# Altium project VHF_AMP.PrjPcb (part 2 of 5)

## Sheet PWR_stage.SchDoc: =MainTitle
size 420 x 297 mm; SheetNumber: 3; SheetTotal: 9; EDA_Number: ARTIQ; Projet: ARTIQ/SINARA; ModifiedBy: -; CreateDate: XX/XX/XXXX; CheckedDate: -; Title2: Power Stage; DivGrp: ISE; Designer: shanasz
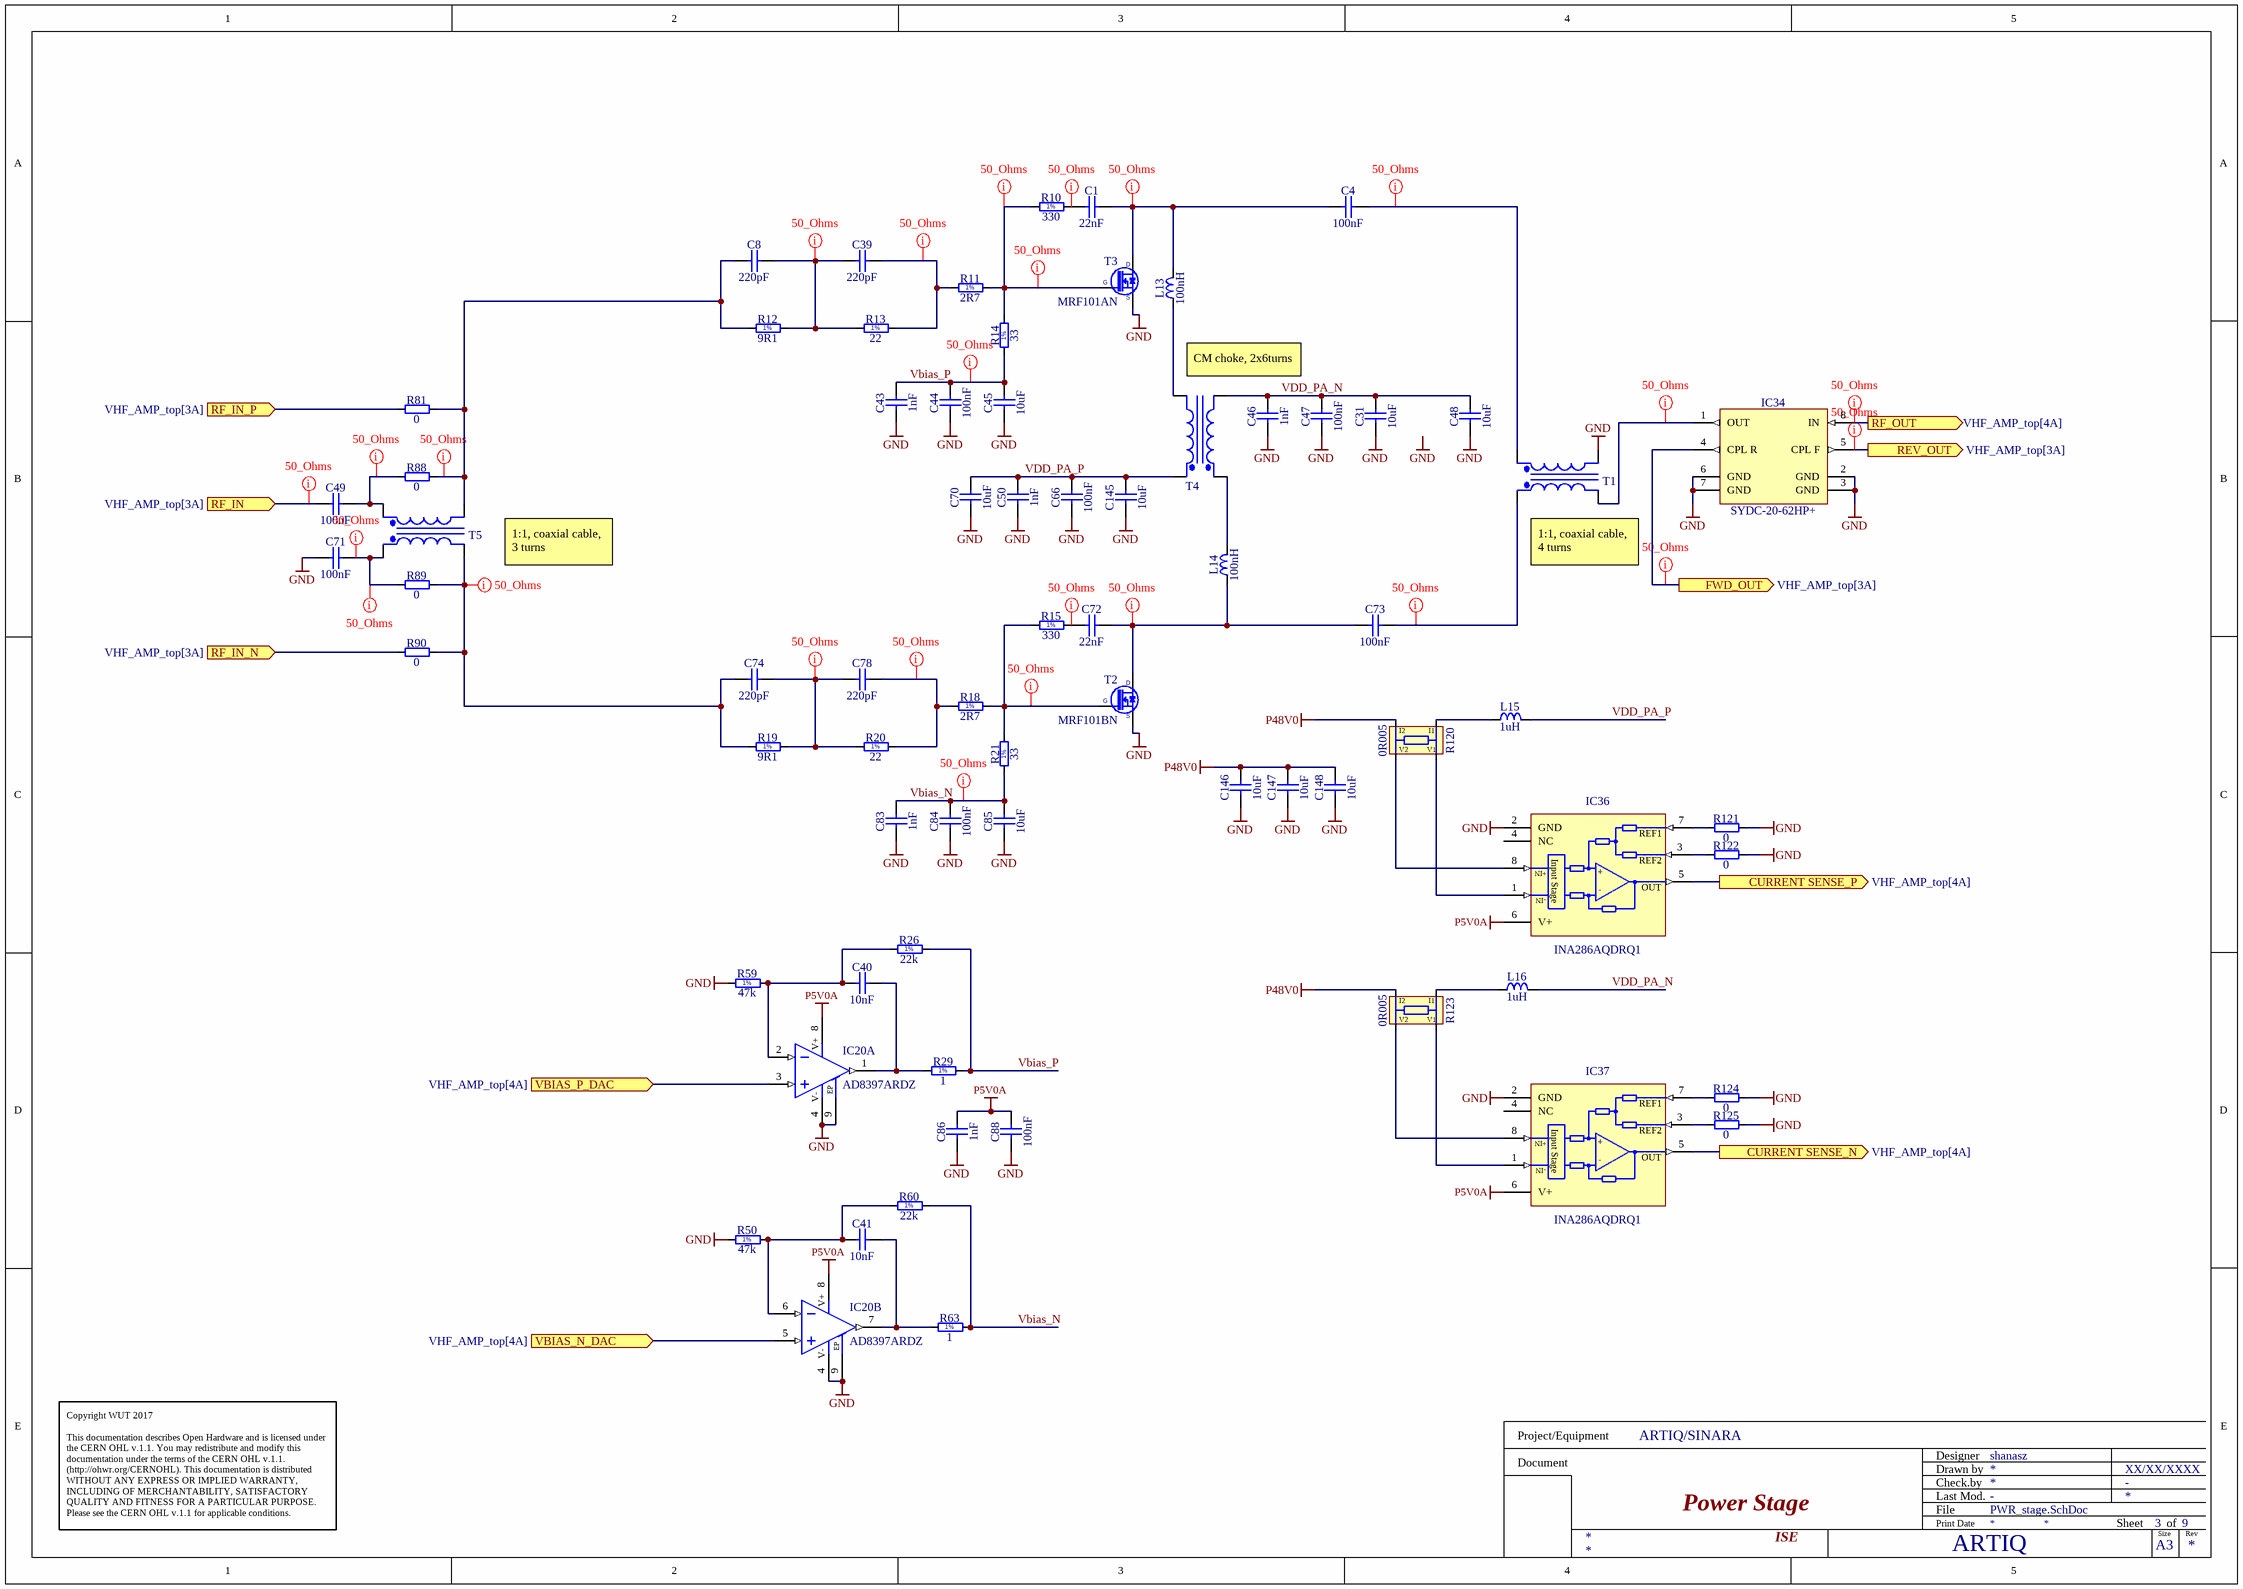
[diagram p2: PWR_stage.SchDoc]

### Parts
C1  22nF  [CAPC2012X135N]
C4  100nF  [CAPC3216X140N]
C8  220pF  [CAPC2012X135N]
C31  10uF  [CAPC_TDK_CKG45N]
C39  220pF  [CAPC2012X135N]
C40  10nF  [CAPC1005X55N]
C41  10nF  [CAPC1005X55N]
C43  1nF  [CAPC2012X135N]
C44  100nF  [CAPC3216X140N]
C45  10uF  [CAPC3225X280N]
C46  1nF  [CAPC2012X135N]
C47  100nF  [CAPC3216X140N]
C48  10uF  [CAPC_TDK_CKG45N]
C49  100nF  [CAPC2012X135N]
C50  1nF  [CAPC2012X135N]
C66  100nF  [CAPC3216X140N]
C70  10uF  [CAPC_TDK_CKG45N]
C71  100nF  [CAPC2012X135N]
C72  22nF  [CAPC2012X135N]
C73  100nF  [CAPC3216X140N]
C74  220pF  [CAPC2012X135N]
C78  220pF  [CAPC2012X135N]
C83  1nF  [CAPC2012X135N]
C84  100nF  [CAPC3216X140N]
C85  10uF  [CAPC3225X280N]
C86  1nF  [CAPC2012X135N]
C88  100nF  [CAPC2012X135N]
C145  10uF  [CAPC_TDK_CKG45N]
C146  10uF  [CAPC_TDK_CKG45N]
C147  10uF  [CAPC_TDK_CKG45N]
C148  10uF  [CAPC_TDK_CKG45N]
IC20  AD8397ARDZ  [SOIC127P600X175-9N-R241X309]  (parts A,B of 2)
IC34  SYDC-20-62HP+  [MINI-CIRCUITS_AH202-1]
IC36  INA286AQDRQ1  [SOIC127P600X175-8N]
IC37  INA286AQDRQ1  [SOIC127P600X175-8N]
L13  100nH  [IND_COILCRAFT_1812SMS]
L14  100nH  [IND_COILCRAFT_1812SMS]
L15  1uH  [IND_BOURNS_SRN3015]
L16  1uH  [IND_BOURNS_SRN3015]
R10  330  [RESC2012X60N]
R11  2R7  [RESC2012X60N]
R12  9R1  [RESC2012X60N]
R13  22  [RESC2012X60N]
R14  33  [RESC2012X60N]
R15  330  [RESC2012X60N]
R18  2R7  [RESC2012X60N]
R19  9R1  [RESC2012X60N]
R20  22  [RESC2012X60N]
R21  33  [RESC2012X60N]
R26  22k  [RESC1005X40N]
R29  1  [RESC1005X40N]
R50  47k  [RESC1005X40N]
R59  47k  [RESC1005X40N]
R60  22k  [RESC1005X40N]
R63  1  [RESC1005X40N]
R81  0  [RESC2012X60N]
R88  0  [RESC2012X60N]
R89  0  [RESC2012X60N]
R90  0  [RESC2012X60N]
R120  0R005  [RES_OHMITE_LVK25]
R121  0  [RESC2012X60N]
R122  0  [RESC2012X60N]
R123  0R005  [RES_OHMITE_LVK25]
R124  0  [RESC2012X60N]
R125  0  [RESC2012X60N]
T1  Trans Ideal  [Balun_5961000601]  (value not drawn)
T2  MRF101BN  [TO-220-HFLIP]
T3  MRF101AN  [TO-220-HFLIP]
T4  Trans Ideal  [Balun_5961000601_power]  (value not drawn)
T5  Trans Ideal  [Balun_5943001101]  (value not drawn)

### Ports
CURRENT SENSE_N (out, see VHF_AMP_top[4A]), CURRENT SENSE_P (out, see VHF_AMP_top[4A]), FWD_OUT (out, see VHF_AMP_top[3A]), REV_OUT (out, see VHF_AMP_top[3A]), RF_IN (in, see VHF_AMP_top[3A]), RF_IN_N (in, see VHF_AMP_top[3A]), RF_IN_P (in, see VHF_AMP_top[3A]), RF_OUT (out, see VHF_AMP_top[4A]), VBIAS_N_DAC (in, see VHF_AMP_top[4A]), VBIAS_P_DAC (in, see VHF_AMP_top[4A])

### Nets
GND: C31.1 C43.1 C44.1 C45.1 C46.1 C47.1 C48.1 C50.1 C66.1 C70.1 C71.1 C83.1 C84.1 C85.1 C86.1 C88.1 C145.1 C146.1 C147.1 C148.1 IC20.4(V-) IC20.9(Exposed_Pad) IC34.2(GND) IC34.3(GND) IC34.6(GND) IC34.7(GND) IC36.2(GND) IC37.2(GND) R50.2 R59.2 R121.2 R122.2 R124.2 R125.2 T1.2(Pri-) T2.2(S) T3.2(S)
P5V0A: C86.2 C88.2 IC20.8(V+) IC36.6(V+) IC37.6(V+)
P48V0: C146.2 C147.2 C148.2 R120.I2 R123.I2
CSN_N_ADC: IC37.5(OUT) ; port CURRENT SENSE_N
CSN_P_ADC: IC36.5(OUT) ; port CURRENT SENSE_P
DRV_out_N: R90.1 ; port RF_IN_N
DRV_out_P: R81.1 ; port RF_IN_P
Vbias_N: C83.2 C84.2 C85.2 R21.1 R60.1 R63.2
VBIAS_N_DAC: IC20.5(IN+) ; port VBIAS_N_DAC
Vbias_P: C43.2 C44.2 C45.2 R14.1 R26.1 R29.2
VBIAS_P_DAC: IC20.3(IN+) ; port VBIAS_P_DAC
VDD_PA_N: C31.2 C46.2 C47.2 C48.2 L16.2 T4.2(Pri-)
VDD_PA_P: C50.2 C66.2 C70.2 C145.2 L15.2 T4.3(Sec+)
NetC1_1: C1.1 R10.2
NetC1_2: C1.2 C4.1 L13.2 T3.3(D)
NetC4_2: C4.2 T1.1(Pri+)
NetC8_1: C8.1 R12.1 R81.2 R88.2 T5.2(Pri-)
NetC8_2: C8.2 C39.1 R12.2 R13.1
NetC39_2: C39.2 R11.1 R13.2
NetC40_1: C40.1 IC20.2(IN-) R26.2 R59.1
NetC40_2: C40.2 IC20.1(OUT) R29.1
NetC41_1: C41.1 IC20.6(IN-) R50.1 R60.2
NetC41_2: C41.2 IC20.7(OUT) R63.1
NetC49_1: C49.1 ; port RF_IN
NetC49_2: C49.2 R88.1 T5.1(Pri+)
NetC71_2: C71.2 R89.1 T5.3(Sec+)
NetC72_1: C72.1 R15.2
NetC72_2: C72.2 C73.1 L14.1 T2.1(D)
NetC73_2: C73.2 T1.3(Sec+)
NetC74_1: C74.1 R19.1 R89.2 R90.2 T5.4(Sec-)
NetC74_2: C74.2 C78.1 R19.2 R20.1
NetC78_2: C78.2 R18.1 R20.2
NetIC34_1: IC34.1(OUT) T1.4(Sec-)
NetIC34_4: IC34.4(CPL_R) ; port FWD_OUT
NetIC34_5: IC34.5(CPL_F) ; port REV_OUT
NetIC34_8: IC34.8(IN) ; port RF_OUT
NetIC36_1: IC36.1(-IN) R120.V1
NetIC36_3: IC36.3(REF2) R122.1
NetIC36_7: IC36.7(REF1) R121.1
NetIC36_8: IC36.8(+IN) R120.V2
NetIC37_1: IC37.1(-IN) R123.V1
NetIC37_3: IC37.3(REF2) R125.1
NetIC37_7: IC37.7(REF1) R124.1
NetIC37_8: IC37.8(+IN) R123.V2
NetL13_1: L13.1 T4.4(Sec-)
NetL14_2: L14.2 T4.1(Pri+)
NetL15_1: L15.1 R120.I1
NetL16_1: L16.1 R123.I1
NetR10_1: R10.1 R11.2 R14.2 T3.1(G)
NetR15_1: R15.1 R18.2 R21.2 T2.3(G)

Not connected (* = marked no-connect by the designer): IC36 4(NC); IC37 4(NC)

### Layout directives
net class 50_Ohms: NetC1_1, NetC1_2, NetC4_2, NetC8_1, NetC8_2, NetC39_2, NetC49_1, NetC49_2, NetC71_2, NetC72_1, NetC72_2, NetC73_2, NetC74_1, NetC74_2, NetC78_2, NetIC34_1, NetIC34_4, NetIC34_5, NetIC34_8, NetR10_1, NetR15_1, Vbias_N, Vbias_P

### Notes on the sheet
- CM choke, 2x6turns
- (near T5) 1:1, coaxial cable, 3 turns
- (near T1) 1:1, coaxial cable, 4 turns
- Labels drawn without touching a wire or pin: GND
- Project/Equipment
- Document
- Designer
- Drawn by
- Check.by
- Copyright WUT 2017
  This documentation describes Open Hardware and is licensed under the CERN OHL v.1.1. You may redistribute and modify this documentation under the terms of the CERN OHL v.1.1. (http://ohwr.org/CERNOHL). This documentation is distributed WITHOUT ANY EXPRESS OR IMPLIED WARRANTY, INCLUDING OF MERCHANTABILITY, SATISFACTORY QUALITY AND FITNESS FOR A PARTICULAR PURPOSE. Please see the CERN OHL v.1.1 for applicable conditions.
- File
- Last Mod.
- Print Date
- Sheet
- Size
- A3
- of
- Rev
- (in symbol AD8397ARDZ, part A) EP
- (in symbol AD8397ARDZ, part B) EP
- (in symbol INA286AQDRQ1) +; Input Stage; -
- (in symbol R0402_1R_1%_0.0625W_200PPM) 1%
- (in symbol R0402_22K_1%_0.0625W_100PPM) 1%
- (in symbol R0402_47K_1%_0.0625W_100PPM) 1%
- (in symbol R0805_2R7_1%_0.125W_200PPM) 1%
- (in symbol R0805_9R1_1%_0.125W_200PPM) 1%
- (in symbol R0805_22R_1%_0.125W_100PPM) 1%
- (in symbol R0805_33R_1%_0.125W_100PPM) 1%
- (in symbol R0805_330R_1%_0.125W_100PPM) 1%

### Library data of the parts
C1 C72 = CC0805_22NF_50V_10%_X7R: Non-polarised capacitor; Part Description: SMD Multilayer Chip Ceramic Capacitor; Manufacturer: GENERIC; Manufacturer1 Part Number: 223858615641; Voltage: 50V; TC: X7R; Tolerance: ±10%; Part Number: CC0805_22NF_50V_10%_X7R; Component Kind: Standard; Component Type: Standard; Pin Count: 2; Value: 22nF; Status: Preferred; Manufacturer Part Number: CC0805_22NF_50V_10%_X7R; Case: 0805; Mounted: Yes; Socket: No; SMD: Yes; Sense: No; Manufacturer1 Example: PHYCOMP; Manufacturer1 ComponentHeight: 1.35mm; HelpURL: \\cern.ch\dfs\Applications\Altium\Datasheets\CC0805_X7R_PHYCOMP.pdf; Author: CERN DEM JLC; CreateDate: 03.12.2007; LatestRevisionDate: 03.12.2007
C4 C44 C47 C66 C73 C84 = CC1206_100NF_100V_10%_X7R: Non-polarised capacitor; Part Description: SMD Multilayer Chip Ceramic Capacitor; Manufacturer: GENERIC; Manufacturer1 Part Number: 222260115649; Voltage: 100V; TC: X7R; Tolerance: ±10%; Part Number: CC1206_100NF_100V_10%_X7R; Component Kind: Standard; Component Type: Standard; Pin Count: 2; Value: 100nF; Status: Preferred; Manufacturer Part Number: CC1206_100NF_100V_10%_X7R; Case: 1206; Mounted: Yes; Socket: No; SMD: Yes; Sense: No; Manufacturer1 Example: PHYCOMP; Manufacturer1 ComponentHeight: 1.25mm; HelpURL: \\cern.ch\dfs\Applications\Altium\Datasheets\CC1206_X7R_PHYCOMP.pdf; Author: CERN DEM JLC; CreateDate: 24.08.2009; LatestRevisionDate: 24.08.2009
C8 C39 C74 C78 = CC0805_220PF_50V_5%_C0G: Non-polarised capacitor; Part Description: SMD Multilayer Chip Ceramic Capacitor; Manufacturer: GENERIC; Manufacturer1 Part Number: C0805C151J5GACTU; Voltage: 50V; TC: C0G/NP0; Tolerance: ±5%; Part Number: CC0805_220PF_50V_5%_C0G; Component Kind: Standard; Component Type: Standard; Pin Count: 2; Value: 220pF; Status: Preferred; Manufacturer Part Number: CC0805_220PF_50V_5%_C0G; Case: 0805; Mounted: Yes; Socket: No; SMD: Yes; Sense: No; Manufacturer1 Example: KEMET; Manufacturer1 ComponentHeight: 0.88mm; HelpURL: \\cern.ch\dfs\Applications\Altium\Datasheets\CC0805_C0G_KEMET_(Commercial Grade).pdf; Author: CERN DEM JLC; CreateDate: 03.12.2007; LatestRevisionDate: 22.04.2015
C31 C48 C70 C145-C148 = CC1812_10UF_100V_20%_X7S_TDK_CKG45N: Non-polarised capacitor; Part Description: Multilayer Ceramic Chip Capacitor - Stacked Cap, CKG45N Series; Manufacturer: TDK; Manufacturer Part Number: CKG45NX7S2A106M500JH; Voltage: 100V; TC: X7S; Tolerance: ±20%; Part Number: CC1812_10UF_100V_20%_X7S_TDK_CKG45N; Component Kind: Standard; Component Type: Standard; Pin Count: 2; Value: 10uF; Status: None; Case: 1812; Mounted: Yes; Socket: No; SMD: Yes; Sense: No; ComponentHeight: 5.5mm; HelpURL: \\cern.ch\dfs\Applications\Altium\Datasheets\CC1812_X7S_TDK_CKG.pdf; Author: CERN DEM MR; CreateDate: 14.12.2017; LatestRevisionDate: 14.12.2017
C40 C41 = CC0402_10NF_16V_10%_X7R: Non-polarised capacitor; Manufacturer: GENERIC; Manufacturer1 Part Number: 223878715636; Part Description: SMD Multilayer Chip Ceramic Capacitor; TC: X7R; Tolerance: ±10%; Voltage: 16V; Case: 0402; Manufacturer Part Number: CC0402_10NF_16V_10%_X7R; Manufacturer1 Example: PHYCOMP; Part Number: CC0402_10NF_16V_10%_X7R; Pin Count: 2; SMD: Yes; Status: Not Recommended; Value: 10nF; Component Kind: Standard; Component Type: Standard; Mounted: Yes; Socket: No; Sense: No; Manufacturer1 ComponentHeight: 0.55mm; HelpURL: \\cern.ch\dfs\Applications\Altium\Datasheets\CC0402_X7R_PHYCOMP.pdf; Author: CERN DEM JLC; CreateDate: 03.12.2007; LatestRevisionDate: 03.12.2007
C43 C46 C50 C83 C86 = CC0805_1NF_50V_5%_C0G: Non-polarised capacitor; Part Description: SMD Multilayer Chip Ceramic Capacitor; Manufacturer: GENERIC; Manufacturer1 Part Number: C0805C102J5GACTU; Voltage: 50V; TC: C0G/NP0; Tolerance: ±5%; Part Number: CC0805_1NF_50V_5%_C0G; Component Kind: Standard; Component Type: Standard; Pin Count: 2; Value: 1nF; Status: None; Manufacturer Part Number: CC0805_1NF_50V_5%_C0G; Case: 0805; Mounted: Yes; Socket: No; SMD: Yes; Sense: No; Manufacturer1 Example: KEMET; Manufacturer1 ComponentHeight: 0.88mm; HelpURL: \\cern.ch\dfs\Applications\Altium\Datasheets\CC0805_C0G_KEMET_(Commercial Grade).pdf; Author: CERN DEM JLC; CreateDate: 02.02.2011; LatestRevisionDate: 22.04.2015
C45 C85 = CC1210_10UF_50V_10%_X7R_YUDEN_UMK325AB7106KMHP: Non-polarised capacitor; Part Description: SMD Multilayer Chip Ceramic Capacitor (High Dielectric Type) for Automotive / Industrial Applications; Manufacturer: TAIYO YUDEN; Voltage: 50V; TC: X7R; Tolerance: ±10%; Part Number: CC1210_10UF_50V_10%_X7R_YUDEN_UMK325AB7106KMHP; Component Kind: Standard; Component Type: Standard; Pin Count: 2; Value: 10uF; Status: Not Recommended; Manufacturer Part Number: UMK325AB7106KMHP; Case: 1210; Mounted: Yes; Socket: No; SMD: Yes; Sense: No; ComponentHeight: 2.8mm; HelpURL: \\cern.ch\dfs\Applications\Altium\Datasheets\CC1210_TAIYO-YUDEN_UMK325AB7106KMHP.pdf; Author: CERN DEM JLC; CreateDate: 30.11.2016; LatestRevisionDate: 30.12.2015
C49 C71 C88 = CC0805_100NF_50V_10%_X7R: Non-polarised capacitor; Part Description: SMD Multilayer Chip Ceramic Capacitor; Manufacturer: GENERIC; Manufacturer1 Part Number: C2012X7R1H104K085AA; Voltage: 50V; TC: X7R; Tolerance: ±10%; Part Number: CC0805_100NF_50V_10%_X7R; Component Kind: Standard; Component Type: Standard; Pin Count: 2; Value: 100nF; Status: Preferred; Manufacturer Part Number: CC0805_100NF_50V_10%_X7R; Case: 0805; Mounted: Yes; Socket: No; SMD: Yes; Sense: No; Manufacturer1 Example: TDK; Manufacturer1 ComponentHeight: 1mm; HelpURL: \\cern.ch\dfs\Applications\Altium\Datasheets\CC0805_X7R_TDK_C.pdf; Author: CERN DEM JLC; CreateDate: 03.12.2007; LatestRevisionDate: 22.04.2015
IC20 = AD8397ARDZ: Dual Operational Amplifier With Exposed Pad; Part Description: Rail-to-Rail, High Output Current Amplifier; Manufacturer: ANALOG DEVICES; PressFit: No; Bonding: No; Part Number: AD8397ARDZ; Component Kind: Standard; Component Type: Standard; Device: AD8397ARDZ; PackageDescription: SOIC 8, Pitch 1.27mm - Body 3.9x4.9mm, (w/thermal tab 2.41mm X 3.098mm), IPC Medium Density; Manufacturer Part Number: AD8397ARDZ; Pin Count: 9; Case: SOIC8; Mounted: Yes; Socket: No; SMD: Yes; Sense: No; ComponentHeight: 1.75mm; Author: CERN DEM JLC; HelpURL: \\cern.ch\dfs\Applications\Altium\Datasheets\AD8397ARDZ.pdf; CreateDate: 31.05.2011; LatestRevisionDate: 31.05.2011
IC34 = SYDC-20-62HP+: 50Ohm, 10 to 540MHz, 25W, 20dB Bi-Directional Coupler; Manufacturer: MINI-CIRCUITS; PressFit: No; Bonding: No; Part Number: SYDC-20-62HP+; Component Kind: Standard; Component Type: Standard; Device: SYDC-20-62HP+; PackageDescription: MINI-CIRCUITS AH202-1 Case, Body 12.7mm L X 9.65mm W X 6.35mm H; Part Description: 50Ohm, 10 to 540MHz, 25W, 20dB Bi-Directional Coupler; Manufacturer Part Number: SYDC-20-62HP+; Pin Count: 8; Mounted: Yes; Socket: No; SMD: Yes; Sense: No; ComponentHeight: 6.35mm; Author: CERN DEM BC; HelpURL: \\cern.ch\dfs\Applications\Altium\Datasheets\SYDC-20-62HP+.pdf; CreateDate: 26.08.2019; LatestRevisionDate: 26.08.2019
IC36 IC37 = INA286AQDRQ1: 80V, Bi-Directional, Low-/High-Side, Voltage Output Current Sense Amplifier; Part Description: 80V, Bi-Directional, Low-/High-Side, Voltage Output Current Sense Amplifier (Automotive Grade); Manufacturer: TEXAS INSTRUMENTS; PressFit: No; Bonding: No; Part Number: INA286AQDRQ1; Component Kind: Standard; Component Type: Standard; Device: INA286AQDRQ1; PackageDescription: SOIC 8, Pitch 1.27mm, Body 4x5mm, IPC Medium Density; Manufacturer Part Number: INA286AQDRQ1; Pin Count: 8; Case: SOIC8; Mounted: Yes; Socket: No; SMD: Yes; Sense: No; ComponentHeight: 1.75mm; Author: CERN DEM JLC; HelpURL: \\cern.ch\dfs\Applications\Altium\Datasheets\INA286AQDRQ1.pdf; CreateDate: 27.09.2018; LatestRevisionDate: 27.09.2018
L13 L14 = IND_100NH_5%_COILCRAFT_1812SMS-R10JLC: Inductor; Part Description: SMD Midi Spring Air Core Inductor; Power: 1.7A; Resistance: 0.0123R; Tolerance: ±5%; Part Number: IND_100NH_5%_COILCRAFT_1812SMS-R10JLC; Component Kind: Standard; Component Type: Standard; Pin Count: 2; Value: 100nH; Status: None; Manufacturer: COILCRAFT; Manufacturer Part Number: 1812SMS-R10JLC; Mounted: Yes; Socket: No; SMD: Yes; Sense: No; ComponentHeight: 4.2mm; HelpURL: \\cern.ch\dfs\Applications\Altium\Datasheets\IND_COILCRAFT_1812SMS.pdf; Author: CERN DEM JLC; CreateDate: 12.02.2015; LatestRevisionDate: 12.02.2015
L15 L16 = IND_1UH_30%_BOURNS_SRN3015: Inductor; Part Description: Semi-Shielded SMD Power Inductor; Manufacturer: BOURNS; Manufacturer Part Number: SRN3015-1R0Y; Power: 2.35A; Resistance: 0.048R; Tolerance: ±30%; Part Number: IND_1UH_30%_BOURNS_SRN3015; Component Kind: Standard; Component Type: Standard; Pin Count: 2; Value: 1uH; Status: None; Mounted: Yes; Socket: No; SMD: Yes; Sense: No; ComponentHeight: 1.5mm; HelpURL: \\cern.ch\dfs\Applications\Altium\Datasheets\IND_BOURNS_SRN3015.pdf; Author: CERN DEM JLC; CreateDate: 03.02.2015; LatestRevisionDate: 03.02.2015
R10 R15 = R0805_330R_1%_0.125W_100PPM: Resistor - 1%; Part Description: General Purpose Thick Film Chip Resistor; Manufacturer: GENERIC; Manufacturer1 Part Number: NRC10F3300TRF; Power: 0.125W; TC: ±100ppm/°C; PressFit: No; Part Number: R0805_330R_1%_0.125W_100PPM; Component Kind: Standard; Component Type: Standard; Pin Count: 2; Value: 330; Status: Preferred; Tolerance: ±1%; Manufacturer Part Number: R0805_330R_1%_0.125W_100PPM; Case: 0805; Mounted: Yes; Sense: No; Socket: No; SMD: Yes; Manufacturer1 Example: NIC COMPONENT; Manufacturer1 ComponentHeight: 0.6mm; HelpURL: \\cern.ch\dfs\Applications\Altium\Datasheets\R0805_NIC_NRC.pdf; Author: CERN DEM JLC; CreateDate: 03.12.2007; LatestRevisionDate: 13.03.2008
R11 R18 = R0805_2R7_1%_0.125W_200PPM: Resistor - 1%; Part Description: General Purpose Thick Film Chip Resistor; Manufacturer: GENERIC; Manufacturer1 Part Number: 232273462708L or RC0805FR-072R7L; Power: 0.125W; TC: ±200ppm/°C; PressFit: No; Part Number: R0805_2R7_1%_0.125W_200PPM; Component Kind: Standard; Component Type: Standard; Pin Count: 2; Value: 2R7; Status: Preferred; Tolerance: ±1%; Manufacturer Part Number: R0805_2R7_1%_0.125W_200PPM; Case: 0805; Mounted: Yes; Sense: No; Socket: No; SMD: Yes; Manufacturer1 Example: YAGEO PHYCOMP; Manufacturer1 ComponentHeight: 0.65mm; HelpURL: \\cern.ch\dfs\Applications\Altium\Datasheets\R0805_Phycomp_RC0805.pdf; Author: CERN DEM JLC; CreateDate: 03.12.2007; LatestRevisionDate: 17.10.2012
R12 R19 = R0805_9R1_1%_0.125W_200PPM: Resistor - 1%; Part Description: General Purpose Thick Film Chip Resistor; Manufacturer: GENERIC; Manufacturer1 Part Number: 232273469108L or RC0805FR-079R1L; Power: 0.125W; TC: ±200ppm/°C; PressFit: No; Part Number: R0805_9R1_1%_0.125W_200PPM; Component Kind: Standard; Component Type: Standard; Pin Count: 2; Value: 9R1; Status: Preferred; Tolerance: ±1%; Manufacturer Part Number: R0805_9R1_1%_0.125W_200PPM; Case: 0805; Mounted: Yes; Sense: No; Socket: No; SMD: Yes; Manufacturer1 Example: YAGEO PHYCOMP; Manufacturer1 ComponentHeight: 0.65mm; HelpURL: \\cern.ch\dfs\Applications\Altium\Datasheets\R0805_Phycomp_RC0805.pdf; Author: CERN DEM JLC; CreateDate: 03.12.2007; LatestRevisionDate: 17.10.2012
R13 R20 = R0805_22R_1%_0.125W_100PPM: Resistor - 1%; Part Description: General Purpose Thick Film Chip Resistor; Manufacturer: GENERIC; Manufacturer1 Part Number: NRC10F22R0TRF; Power: 0.125W; TC: ±100ppm/°C; PressFit: No; Part Number: R0805_22R_1%_0.125W_100PPM; Component Kind: Standard; Component Type: Standard; Pin Count: 2; Value: 22; Status: Preferred; Tolerance: ±1%; Manufacturer Part Number: R0805_22R_1%_0.125W_100PPM; Case: 0805; Mounted: Yes; Sense: No; Socket: No; SMD: Yes; Manufacturer1 Example: NIC COMPONENT; Manufacturer1 ComponentHeight: 0.6mm; HelpURL: \\cern.ch\dfs\Applications\Altium\Datasheets\R0805_NIC_NRC.pdf; Author: CERN DEM JLC; CreateDate: 03.12.2007; LatestRevisionDate: 13.03.2008
R14 R21 = R0805_33R_1%_0.125W_100PPM: Resistor - 1%; Part Description: General Purpose Thick Film Chip Resistor; Manufacturer: GENERIC; Manufacturer1 Part Number: NRC10F33R0TRF; Power: 0.125W; TC: ±100ppm/°C; PressFit: No; Part Number: R0805_33R_1%_0.125W_100PPM; Component Kind: Standard; Component Type: Standard; Pin Count: 2; Value: 33; Status: Preferred; Tolerance: ±1%; Manufacturer Part Number: R0805_33R_1%_0.125W_100PPM; Case: 0805; Mounted: Yes; Sense: No; Socket: No; SMD: Yes; Manufacturer1 Example: NIC COMPONENT; Manufacturer1 ComponentHeight: 0.6mm; HelpURL: \\cern.ch\dfs\Applications\Altium\Datasheets\R0805_NIC_NRC.pdf; Author: CERN DEM JLC; CreateDate: 03.12.2007; LatestRevisionDate: 13.03.2008
R26 R60 = R0402_22K_1%_0.0625W_100PPM: Resistor - 1%; Part Description: General Purpose Thick Film Chip Resistor; Manufacturer: GENERIC; Manufacturer1 Part Number: 232270672203L; TC: ±100ppm/°C; PressFit: No; Part Number: R0402_22K_1%_0.0625W_100PPM; Component Kind: Standard; Component Type: Standard; Pin Count: 2; Value: 22k; Status: Not Recommended; Power: 0.0625W; Tolerance: ±1%; Manufacturer Part Number: R0402_22K_1%_0.0625W_100PPM; Case: 0402; Mounted: Yes; Sense: No; Socket: No; SMD: Yes; Manufacturer1 Example: YAGEO PHYCOMP; Manufacturer1 ComponentHeight: 0.4mm; HelpURL: \\cern.ch\dfs\Applications\Altium\Datasheets\R0402_Phycomp_RC0402.pdf; Author: CERN DEM JLC; CreateDate: 03.12.2007; LatestRevisionDate: 17.10.2012
R29 R63 = R0402_1R_1%_0.0625W_200PPM: Resistor - 1%; Part Description: General Purpose Thick Film Chip Resistor; Manufacturer: GENERIC; Manufacturer1 Part Number: 232270671008L; TC: ±200ppm/°C; PressFit: No; Part Number: R0402_1R_1%_0.0625W_200PPM; Component Kind: Standard; Component Type: Standard; Pin Count: 2; Value: 1; Status: Not Recommended; Power: 0.0625W; Tolerance: ±1%; Manufacturer Part Number: R0402_1R_1%_0.0625W_200PPM; Case: 0402; Mounted: Yes; Sense: No; Socket: No; SMD: Yes; Manufacturer1 Example: YAGEO PHYCOMP; Manufacturer1 ComponentHeight: 0.4mm; HelpURL: \\cern.ch\dfs\Applications\Altium\Datasheets\R0402_Phycomp_RC0402.pdf; Author: CERN DEM JLC; CreateDate: 03.12.2007; LatestRevisionDate: 17.10.2012
R50 R59 = R0402_47K_1%_0.0625W_100PPM: Resistor - 1%; Part Description: General Purpose Thick Film Chip Resistor; Manufacturer: GENERIC; Manufacturer1 Part Number: 232270675103L; TC: ±100ppm/°C; PressFit: No; Part Number: R0402_47K_1%_0.0625W_100PPM; Component Kind: Standard; Component Type: Standard; Pin Count: 2; Value: 47k; Status: Not Recommended; Power: 0.0625W; Tolerance: ±1%; Manufacturer Part Number: R0402_47K_1%_0.0625W_100PPM; Case: 0402; Mounted: Yes; Sense: No; Socket: No; SMD: Yes; Manufacturer1 Example: YAGEO PHYCOMP; Manufacturer1 ComponentHeight: 0.4mm; HelpURL: \\cern.ch\dfs\Applications\Altium\Datasheets\R0402_Phycomp_RC0402.pdf; Author: CERN DEM JLC; CreateDate: 03.12.2007; LatestRevisionDate: 17.10.2012
R81 R88-R90 R121 R122 R124 R125 = R0805_0R_JUMPER: Resistor; Part Description: 2A (0.05R Max DC Resistance) Zero Ohm Jumper; Manufacturer: GENERIC; Manufacturer1 Part Number: NRC10Z0; PressFit: No; Part Number: R0805_0R_JUMPER; Component Kind: Standard; Component Type: Standard; Pin Count: 2; Value: 0; Status: Preferred; Manufacturer Part Number: R0805_0R_JUMPER; Case: 0805; Mounted: Yes; Sense: No; Socket: No; SMD: Yes; Manufacturer1 Example: NIC COMPONENT; Manufacturer1 ComponentHeight: 0.6mm; HelpURL: \\cern.ch\dfs\Applications\Altium\Datasheets\R0805_NIC_NRC.pdf; Author: CERN DEM JLC; CreateDate: 03.12.2007; LatestRevisionDate: 13.03.2008
R120 R123 = R_0R005_0.5%_2W_100PPM_OHMITE_LVK25: Power and Current Sensing Resistor; Part Description: Four Terminal High Precision Current Sense; Manufacturer: OHMITE; Manufacturer Part Number: LVK25R005DER; Power: 2W; TC: ±100ppm/°C; Tolerance: ±0.5%; PressFit: No; Part Number: R_0R005_0.5%_2W_100PPM_OHMITE_LVK25; Component Kind: Standard; Component Type: Standard; Pin Count: 4; Value: 0R005; Status: None; Mounted: Yes; Sense: No; Socket: No; SMD: Yes; ComponentHeight: 0.7mm; HelpURL: \\cern.ch\dfs\Applications\Altium\Datasheets\R_OHMITE_LVK25.pdf; Author: CERN DEM JLC; CreateDate: 21.02.2018; LatestRevisionDate: 21.02.2018
T1 T4 T5 = Balun_coaxialcable: Transformer (Ideal); Published: 8-Jun-2000; LatestRevisionDate: 17-Jul-2002; LatestRevisionNote: Re-released for DXP Platform.; PackageReference: TRF_4; Publisher: Altium Limited; PackageDescription: Transformer; 4 Leads
T2 = MRF101BN_hflip: N-CHANNEL MOSFET WITH DIODE; Part Description: 133V 115W NPN Silicon Plastic Power Transistor; Manufacturer: NXP SEMICONDUCTORS; PressFit: No; Bonding: No; Part Number: MRF101BN_hflip; Component Kind: Standard; Component Type: Standard; Device: MRF101BN; PackageDescription: TO-220 3-Terminal + Tab - Flipped Horizontal Mount; Manufacturer Part Number: MRF101BN; Pin Count: 3; Case: TO-220; Mounted: Yes; Socket: No; SMD: No; Sense: No; ComponentHeight: 4.83mm; HelpURL: \\cern.ch\dfs\Applications\Altium\Datasheets\MRF101BN.pdf; Author: CERN DEM HF; CreateDate: 13.04.2023; LatestRevisionDate: 13.04.2023
T3 = MRF101AN_hflip: N-CHANNEL MOSFET WITH DIODE; Part Description: 133V 115W NPN Silicon Plastic Power Transistor; Manufacturer: NXP SEMICONDUCTORS; PressFit: No; Bonding: No; Part Number: MRF101AN_hflip; Component Kind: Standard; Component Type: Standard; Device: MRF101AN; PackageDescription: TO-220 3-Terminal + Tab - Flipped Horizontal Mount; Manufacturer Part Number: MRF101AN; Pin Count: 3; Case: TO-220; Mounted: Yes; Socket: No; SMD: No; Sense: No; ComponentHeight: 4.83mm; HelpURL: \\cern.ch\dfs\Applications\Altium\Datasheets\MRF101AN.pdf; Author: CERN DEM HF; CreateDate: 06.04.2023; LatestRevisionDate: 06.04.2023

## Sheet RF_Driver.SchDoc: =MainTitle
size 420 x 297 mm; SheetNumber: 4; SheetTotal: 9; EDA_Number: ARTIQ; Projet: ARTIQ/SINARA; ModifiedBy: -; CreateDate: XX/XX/XXXX; CheckedDate: -; Title2: Driver Amplifier; DivGrp: ISE; Designer: shanasz
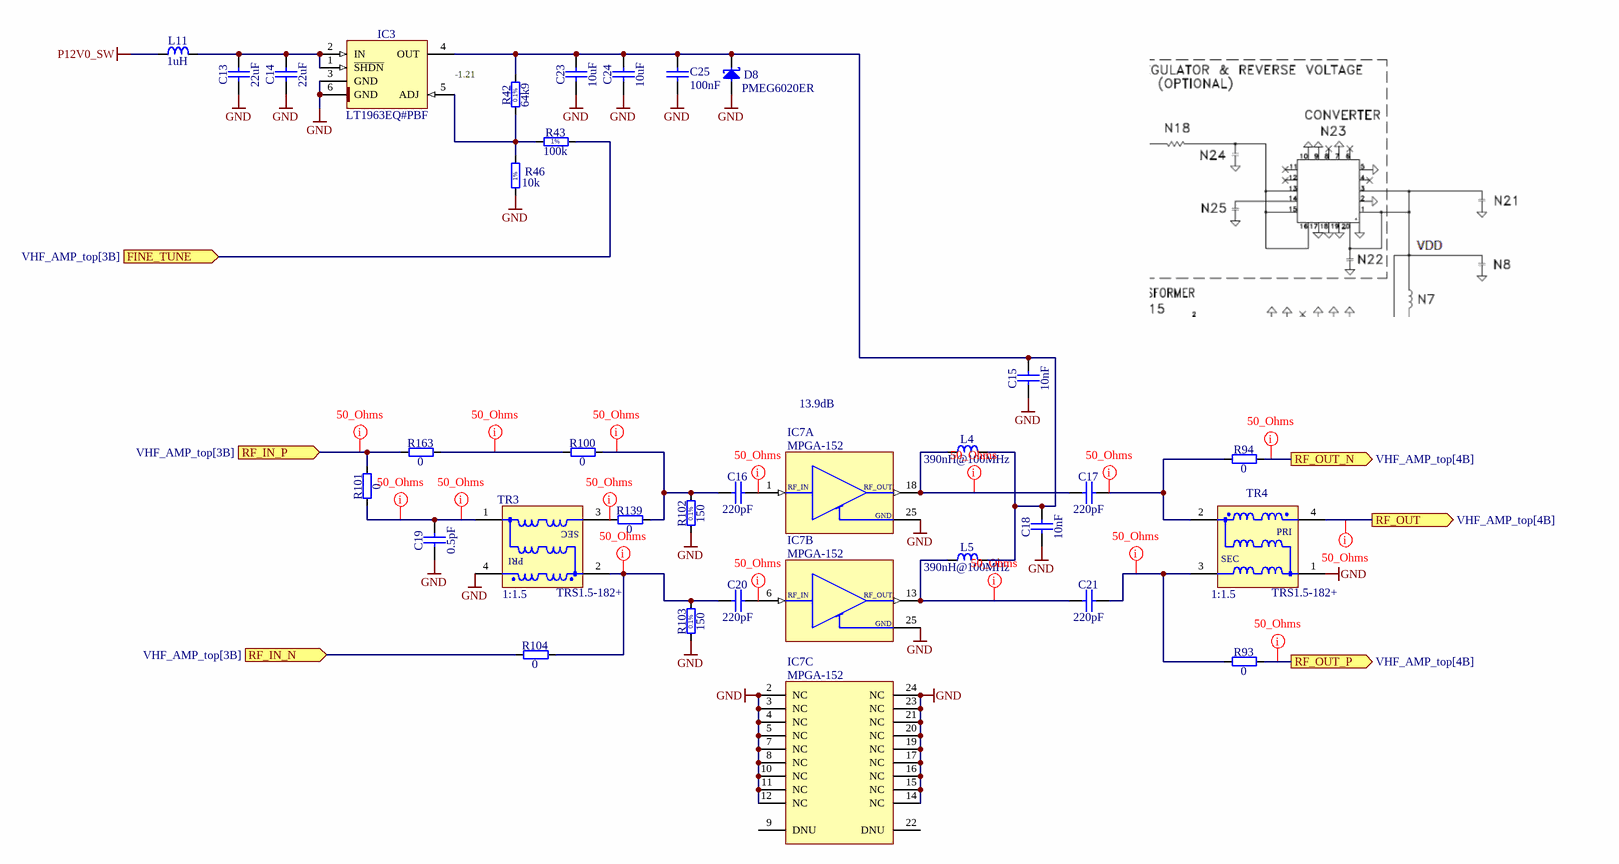
[diagram p3: RF_Driver.SchDoc]

### Parts
C13  22uF  [CAPC3225X140N]
C14  22uF  [CAPC3225X140N]
C15  10nF  [CAPC1005X55N]
C16  220pF  [CAPC1005X55N]
C17  220pF  [CAPC1005X55N]
C18  10nF  [CAPC1005X55N]
C19  0.5pF  [CAPC1005X50N]
C20  220pF  [CAPC1005X55N]
C21  220pF  [CAPC1005X55N]
C23  10uF  [CAPC3225X270N]
C24  10uF  [CAPC3225X270N]
C25  100nF  [CAPC1005X55N]
D8  PMEG6020ER  [SODFL3517X110N]
IC3  LT1963EQ#PBF  [TO170P1394X457-6N-R900X1060]
IC7  MPGA-152  [QFN50P400X400X100-25N-S265]  (parts A,B,C of 3)
L4  390nH@100MHz  [IND_COILCRAFT_0805HP]
L5  390nH@100MHz  [IND_COILCRAFT_0805HP]
L11  1uH  [INDC2620X100N]
R42  64k9  [RESC1608X55N]
R43  100k  [RESC1608X55N]
R46  10k  [RESC1005X40N]
R93  0  [RESC2012X60N]
R94  0  [RESC2012X60N]
R100  0  [RESC2012X60N]
R101  0  [RESC2012X60N]
R102  150  [RESC1608X55N]
R103  150  [RESC1608X55N]
R104  0  [RESC2012X60N]
R139  0  [RESC2012X60N]
R163  0  [RESC2012X60N]
TR3  1:1.5  Manufacturer Part Number: TRS1.5-182+  [XFMR_MINI-CIRCUITS_TT1618]
TR4  1:1.5  Manufacturer Part Number: TRS1.5-182+  [XFMR_MINI-CIRCUITS_TT1618]

### Ports
FINE_TUNE (in, see VHF_AMP_top[3B]), RF_IN_N (in, see VHF_AMP_top[3B]), RF_IN_P (in, see VHF_AMP_top[3B]), RF_OUT (out, see VHF_AMP_top[4B]), RF_OUT_N (out, see VHF_AMP_top[4B]), RF_OUT_P (out, see VHF_AMP_top[4B])

### Nets
GND: C13.1 C14.1 C15.1 C18.1 C19.1 C23.1 C24.1 C25.2 D8.2(A) IC3.3(GND) IC3.6(GND) IC7.2(NC) IC7.3(NC) IC7.4(NC) IC7.5(NC) IC7.7(NC) IC7.8(NC) IC7.10(NC) IC7.11(NC) IC7.12(NC) IC7.14(NC) IC7.15(NC) IC7.16(NC) IC7.17(NC) IC7.19(NC) IC7.20(NC) IC7.21(NC) IC7.23(NC) IC7.24(NC) IC7.25(GND) R46.1 R102.1 R103.1 TR3.4(P1) TR4.1(P1)
P12V0_SW: L11.1
DRV_out_N: R94.2 ; port RF_OUT_N
DRV_out_P: R93.2 ; port RF_OUT_P
FINE_TUNE_0V_P2V5: R43.2 ; port FINE_TUNE
PRE_out_N: R101.2 R163.1 ; port RF_IN_P
PRE_out_P: R104.1 ; port RF_IN_N
NetC13_2: C13.2 C14.2 IC3.1(~{SHDN}) IC3.2(IN) L11.2
NetC15_2: C15.2 C18.2 C23.2 C24.2 C25.1 D8.1(C) IC3.4(OUT) L4.2 L5.2 R42.2
NetC16_1: C16.1 R100.2 R102.2 R139.2
NetC16_2: C16.2 IC7.1(RF-IN,_A1)
NetC17_1: C17.1 IC7.18(RF-OUT_and_DC-IN,_A1) L4.1
NetC17_2: C17.2 R94.1 TR4.2(S1)
NetC19_2: C19.2 R101.1 TR3.1(P1)
NetC20_1: C20.1 R103.2 R104.2 TR3.2(S1)
NetC20_2: C20.2 IC7.6(RF_IN,_A2)
NetC21_1: C21.1 IC7.13(RF-OUT_and_DC-IN,_A2) L5.1
NetC21_2: C21.2 R93.1 TR4.3(S1)
NetC49_1: TR4.4(P1) ; port RF_OUT
NetIC3_5: IC3.5(ADJ) R42.1 R43.1 R46.2
NetR100_1: R100.1 R163.2
NetR139_1: R139.1 TR3.3(S1)

Not connected (* = marked no-connect by the designer): IC7 9(DNU) 22(DNU)

### Layout directives
net class 50_Ohms: DRV_out_N, DRV_out_P, NetC16_1, NetC16_2, NetC17_1, NetC17_2, NetC19_2, NetC20_1, NetC20_2, NetC21_1, NetC21_2, NetC49_1, NetR100_1, NetR139_1, PRE_out_N

### Notes on the sheet
- -1.21
- 13.9dB
- Project/Equipment
- Document
- Designer
- Drawn by
- Check.by
- Copyright WUT 2017
  This documentation describes Open Hardware and is licensed under the CERN OHL v.1.1. You may redistribute and modify this documentation under the terms of the CERN OHL v.1.1. (http://ohwr.org/CERNOHL). This documentation is distributed WITHOUT ANY EXPRESS OR IMPLIED WARRANTY, INCLUDING OF MERCHANTABILITY, SATISFACTORY QUALITY AND FITNESS FOR A PARTICULAR PURPOSE. Please see the CERN OHL v.1.1 for applicable conditions.
- File
- Last Mod.
- Print Date
- Sheet
- Size
- A3
- of
- Rev
- (in symbol MPGA-152, part A) RF_IN; RF_OUT
- (in symbol MPGA-152, part B) RF_IN; RF_OUT
- (in symbol R0402_10K_1%_0.0625W_100PPM) 1%
- (in symbol R0603_64K9_0.1%_0.063W_10PPM) 0.1%
- (in symbol R0603_100K_1%_0.1W_100PPM) 1%
- (in symbol R0603_150R_0.1%_0.063W_10PPM) 0.1%
- (in symbol XFMR_MINI-CIRCUITS_TRS1.5-182+) SEC; PRI

### Library data of the parts
C13 C14 = CC1210_22UF_25V_20%_X7R: Non-polarised capacitor; Part Description: SMD Multilayer Chip Ceramic Capacitor; Manufacturer: GENERIC; Manufacturer1 Part Number: C1210C226M3RACTU; Voltage: 25V; TC: X7R; Tolerance: ±20%; Part Number: CC1210_22UF_25V_20%_X7R; Component Kind: Standard; Component Type: Standard; Pin Count: 2; Value: 22uF; Status: None; Manufacturer Part Number: CC1210_22UF_25V_20%_X7R; Case: 1210; Mounted: Yes; Socket: No; SMD: Yes; Sense: No; Manufacturer1 Example: KEMET; Manufacturer1 ComponentHeight: 1.4mm; HelpURL: \\cern.ch\dfs\Applications\Altium\Datasheets\CC1210_X7R_KEMET.pdf; Author: CERN DEM JLC; CreateDate: 20.02.2018; LatestRevisionDate: 20.02.2018
C15 C18 = CC0402_10NF_16V_10%_X7R: Non-polarised capacitor; Part Description: SMD Multilayer Chip Ceramic Capacitor; Manufacturer: GENERIC; Manufacturer1 Part Number: 223878715636; Voltage: 16V; TC: X7R; Tolerance: ±10%; Part Number: CC0402_10NF_16V_10%_X7R; Component Kind: Standard; Component Type: Standard; Pin Count: 2; Value: 10nF; Status: Not Recommended; Manufacturer Part Number: CC0402_10NF_16V_10%_X7R; Case: 0402; Mounted: Yes; Socket: No; SMD: Yes; Sense: No; Manufacturer1 Example: PHYCOMP; Manufacturer1 ComponentHeight: 0.55mm; HelpURL: \\cern.ch\dfs\Applications\Altium\Datasheets\CC0402_X7R_PHYCOMP.pdf; Author: CERN DEM JLC; CreateDate: 03.12.2007; LatestRevisionDate: 03.12.2007
C16 C17 C20 C21 = CC0402_220PF_50V_5%_C0G: Non-polarised capacitor; Part Description: SMD Multilayer Chip Ceramic Capacitor; Manufacturer: GENERIC; Manufacturer1 Part Number: C0402C221J5GACTU; Voltage: 50V; TC: C0G/NP0; Tolerance: ±5%; Part Number: CC0402_220PF_50V_5%_C0G; Component Kind: Standard; Component Type: Standard; Pin Count: 2; Value: 220pF; Status: Preferred; Manufacturer Part Number: CC0402_220PF_50V_5%_C0G; Case: 0402; Mounted: Yes; Socket: No; SMD: Yes; Sense: No; Manufacturer1 Example: KEMET; Manufacturer1 ComponentHeight: 0.55mm; HelpURL: \\cern.ch\dfs\Applications\Altium\Datasheets\CC0402_C0G_KEMET_(Commercial Grade).pdf; Author: CERN DEM JLC; CreateDate: 03.12.2007; LatestRevisionDate: 22.04.2015
C19 = CC0402_0.5PF_25V_0.05PF_AVX_04023J0R5ABSTR: Non-polarised capacitor; Part Description: Thin-Film Chip Capacitor for RF Signal and Power Applications, Accu-P Series; Manufacturer: AVX; Voltage: 25V; Tolerance: ±0.05pF; Part Number: CC0402_0.5PF_25V_0.05PF_AVX_04023J0R5ABSTR; Component Kind: Standard; Component Type: Standard; Pin Count: 2; Value: 0.5pF; Status: None; Manufacturer Part Number: 04023J0R5ABSTR; Case: 0402; Mounted: Yes; Socket: No; SMD: Yes; Sense: No; ComponentHeight: 0.5mm; HelpURL: \\cern.ch\dfs\Applications\Altium\Datasheets\CC0402_AVX_ACCU-P.pdf; Author: CERN DEM JLC; CreateDate: 22.02.2017; LatestRevisionDate: 22.02.2017
C23 C24 = CC1210_10UF_25V_10%_X7R: Non-polarised capacitor; Part Description: SMD Multilayer Chip Ceramic Capacitor; Manufacturer: GENERIC; Manufacturer1 Part Number: C1210C106K4RACTU; Voltage: 25V; TC: X7R; Tolerance: ±10%; Part Number: CC1210_10UF_25V_10%_X7R; Component Kind: Standard; Component Type: Standard; Pin Count: 2; Value: 10uF; Status: None; Manufacturer Part Number: CC1210_10UF_25V_10%_X7R; Case: 1210; Mounted: Yes; Socket: No; SMD: Yes; Sense: No; Manufacturer1 Example: KEMET; Manufacturer1 ComponentHeight: 2.7mm; HelpURL: \\cern.ch\dfs\Applications\Altium\Datasheets\CC1210_X7R_KEMET.pdf; Author: CERN DEM JLC; CreateDate: 05.05.2009; LatestRevisionDate: 01.04.2010
C25 = CC0402_100NF_16V_10%_X5R: Non-polarised capacitor; Part Description: SMD Multilayer Chip Ceramic Capacitor; Manufacturer: GENERIC; Manufacturer1 Part Number: GRM155R61C104KA88D; Voltage: 16V; TC: X5R; Tolerance: ±10%; Part Number: CC0402_100NF_16V_10%_X5R; Component Kind: Standard; Component Type: Standard; Pin Count: 2; Value: 100nF; Status: None; Manufacturer Part Number: CC0402_100NF_16V_10%_X5R; Case: 0402; Mounted: Yes; Socket: No; SMD: Yes; Sense: No; Manufacturer1 Example: MURATA; Manufacturer1 ComponentHeight: 0.55mm; HelpURL: \\cern.ch\dfs\Applications\Altium\Datasheets\CC0402_X5R_MURATA_GRM.pdf; Author: CERN DEM JLC; CreateDate: 10.12.2013; LatestRevisionDate: 10.12.2013
D8 = PMEG6020ER: Schottky Diode; Part Description: MEGA Schottky Barrier Rectifier; Manufacturer: NXP SEMICONDUCTORS; Voltage: 60V; Power: 2A; PressFit: No; Bonding: No; Part Number: PMEG6020ER; Component Kind: Standard; Component Type: Standard; Device: PMEG6020ER; PackageDescription: SODFL Diode (SOD123W); 2.60mm W X 1.70mm L X 1.10mm H body, IPC Medium Density; Manufacturer Part Number: PMEG6020ER; Pin Count: 2; Case: SOD123; Mounted: Yes; Socket: No; SMD: Yes; Sense: No; ComponentHeight: 0.65mm; HelpURL: \\cern.ch\dfs\Applications\Altium\Datasheets\PMEG6020ER.pdf; Author: CERN DEM JMW; CreateDate: 19.06.2014; LatestRevisionDate: 19.06.2014
IC3 = LT1963EQ#PBF: 1.5A, Fast Transient Response Adjustable LDO Regulators; Part Description: 1.5A, 1.21V to 20V, Fast Transient Response, Adjustable LDO Regulator; Manufacturer: LINEAR TECHNOLOGY; PressFit: No; Bonding: No; Part Number: LT1963EQ#PBF; Component Kind: Standard; Component Type: Standard; Device: LT1963EQ#PBF; PackageDescription: D2PAK TO-263, TO, 1.70mm Pitch; 5 Pin, 13.945mm L X 8.89mm W X 4.572mm H body, IPC Medium Density; Manufacturer Part Number: LT1963EQ#PBF; Pin Count: 6; Case: TO-263; Mounted: Yes; Socket: No; SMD: Yes; Sense: No; ComponentHeight: 4.57mm; HelpURL: \\cern.ch\dfs\Applications\Altium\Datasheets\LT1963EQ#PBF.pdf; Author: CERN DEM JLC; CreateDate: 17.12.2013; LatestRevisionDate: 17.12.2013
IC7 = MPGA-152: Dual Differential Inputs and  Complementary TTL outputs; Part Description: 30GHz to 1500MHz, 50 Ohm, Low Noise, High IP3, Monolithic Amplifier; Manufacturer: MINI-CIRCUITS; PressFit: No; Bonding: No; Part Number: MPGA-152; Component Kind: Standard; Component Type: Standard; Device: MPGA-152; PackageDescription: QFN, 0.50mm Pitch, Square; 24 Pin, 4.00mm L X 4.00mm W X 1.00mm H body (w/Thermal Tab 2.65 X 2.65mm), IPC Medium Density; Manufacturer Part Number: MPGA-152; Pin Count: 25; Case: QFN24; Mounted: Yes; Socket: No; SMD: Yes; Sense: No; ComponentHeight: 1mm; Author: CERN DEM HF; HelpURL: \\cern.ch\dfs\Applications\Altium\Datasheets\MPGA-152.pdf; ComponentLink1URL: \\cern.ch\dfs\Applications\Altium\Datasheets\MINI-CIRCUITS_MPGA-152.pdf; ComponentLink1Description: Package Drawing; CreateDate: 30.05.2023; LatestRevisionDate: 30.05.2023
L4 L5 = IND0805_COILCRAFT_0805HP-391XGR: Inductor; Part Description: Chip Inductor; Power: 330mA; Resistance: 1.11R; Tolerance: ±2%; Part Number: IND0805_COILCRAFT_0805HP-391XGR; Component Kind: Standard; Component Type: Standard; Pin Count: 2; Value: 390nH@100MHz; Manufacturer: COILCRAFT; Manufacturer Part Number: 0805HP-391XGR; Case: 0805; Mounted: Yes; Socket: No; SMD: Yes; Sense: No; ComponentHeight: 1.55mm; HelpURL: \\cern.ch\dfs\Applications\Altium\Datasheets\IND_COILCRAFT_0805HP.pdf; Author: CERN DEM JLC; CreateDate: 21.03.2018; LatestRevisionDate: 21.03.2018
L11 = IND1008_1UH_20%_WURTH_74479787210B: Inductor; Part Description: Power Multilayer Inductor (WE-PMI Series); Manufacturer: WURTH ELEKTRONIK; Power: 1.95A; Resistance: 0.06R; Tolerance: ±20%; Part Number: IND1008_1UH_20%_WURTH_74479787210B; Component Kind: Standard; Component Type: Standard; Pin Count: 2; Value: 1uH; Status: None; Manufacturer Part Number: 74479787210B; Mounted: Yes; Socket: No; SMD: Yes; Sense: No; ComponentHeight: 1mm; HelpURL: \\cern.ch\dfs\Applications\Altium\Datasheets\IND_WURTH_WE-PMI_74479787210B.pdf; Author: CERN DEM JLC; CreateDate: 01.10.2014; LatestRevisionDate: 01.10.2014; Case: 1008
R42 = R0603_64K9_0.1%_0.063W_10PPM: Resistor - 0.1%; Part Description: Thin Film Chip Resistor; Manufacturer: GENERIC; Manufacturer1 Part Number: RN73C1J64K9BTDF; Power: 0.063W; TC: ±10ppm; PressFit: No; Part Number: R0603_64K9_0.1%_0.063W_10PPM; Component Kind: Standard; Component Type: Standard; Pin Count: 2; Value: 64k9; Status: Not Recommended; Tolerance: ±0.1%; Manufacturer Part Number: R0603_64K9_0.1%_0.063W_10PPM; Case: 0603; Mounted: Yes; Sense: No; Socket: No; SMD: Yes; Manufacturer1 Example: TYCO HOLSWORTHY; Manufacturer1 ComponentHeight: 0.5mm; HelpURL: \\cern.ch\dfs\Applications\Altium\Datasheets\R0603_Tyco_RN73.pdf; Author: CERN DEM JLC; CreateDate: 03.12.2007; LatestRevisionDate: 13.03.2008
R43 = R0603_100K_1%_0.1W_100PPM: Resistor - 1%; Part Description: General Purpose Thick Film Chip Resistor; Manufacturer: GENERIC; Manufacturer1 Part Number: NRC06F1003TRF; Power: 0.1W; TC: ±100ppm/°C; PressFit: No; Part Number: R0603_100K_1%_0.1W_100PPM; Component Kind: Standard; Component Type: Standard; Pin Count: 2; Value: 100k; Status: Preferred; Tolerance: ±1%; Manufacturer Part Number: R0603_100K_1%_0.1W_100PPM; Case: 0603; Mounted: Yes; Sense: No; Socket: No; SMD: Yes; Manufacturer1 Example: NIC COMPONENT; Manufacturer1 ComponentHeight: 0.55mm; HelpURL: \\cern.ch\dfs\Applications\Altium\Datasheets\R0603_NIC_NRC.pdf; Author: CERN DEM JLC; CreateDate: 03.12.2007; LatestRevisionDate: 13.03.2008
R46 = R0402_10K_1%_0.0625W_100PPM: Resistor - 1%; Part Description: General Purpose Thick Film Chip Resistor; Manufacturer: GENERIC; Manufacturer1 Part Number: 232270671003L; TC: ±100ppm/°C; PressFit: No; Part Number: R0402_10K_1%_0.0625W_100PPM; Component Kind: Standard; Component Type: Standard; Pin Count: 2; Value: 10k; Status: Not Recommended; Power: 0.0625W; Tolerance: ±1%; Manufacturer Part Number: R0402_10K_1%_0.0625W_100PPM; Case: 0402; Mounted: Yes; Sense: No; Socket: No; SMD: Yes; Manufacturer1 Example: YAGEO PHYCOMP; Manufacturer1 ComponentHeight: 0.4mm; HelpURL: \\cern.ch\dfs\Applications\Altium\Datasheets\R0402_Phycomp_RC0402.pdf; Author: CERN DEM JLC; CreateDate: 03.12.2007; LatestRevisionDate: 17.10.2012
R93 R94 R100 R101 R104 R139 R163 = R0805_0R_JUMPER: as R81 on sheet PWR_stage; Part Number: R0805_0R_JUMPER; Component Kind: Standard; Component Type: Standard; Pin Count: 2; Value: 0; Status: Preferred; Manufacturer Part Number: R0805_0R_JUMPER; Case: 0805; Mounted: Yes; Sense: No; Socket: No; SMD: Yes; Manufacturer1 Example: NIC COMPONENT; Manufacturer1 ComponentHeight: 0.6mm; HelpURL: \\cern.ch\dfs\Applications\Altium\Datasheets\R0805_NIC_NRC.pdf; Author: CERN DEM JLC; CreateDate: 03.12.2007; LatestRevisionDate: 13.03.2008
R102 R103 = R0603_150R_0.1%_0.063W_10PPM: Resistor - 0.1%; Part Description: Thin Film Chip Resistor; Manufacturer: GENERIC; Manufacturer1 Part Number: RN73C1J150RBTDF; Power: 0.063W; TC: ±10ppm; PressFit: No; Part Number: R0603_150R_0.1%_0.063W_10PPM; Component Kind: Standard; Component Type: Standard; Pin Count: 2; Value: 150; Status: Not Recommended; Tolerance: ±0.1%; Manufacturer Part Number: R0603_150R_0.1%_0.063W_10PPM; Case: 0603; Mounted: Yes; Sense: No; Socket: No; SMD: Yes; Manufacturer1 Example: TYCO HOLSWORTHY; Manufacturer1 ComponentHeight: 0.5mm; HelpURL: \\cern.ch\dfs\Applications\Altium\Datasheets\R0603_Tyco_RN73.pdf; Author: CERN DEM JLC; CreateDate: 03.12.2007; LatestRevisionDate: 13.03.2008
TR3 TR4 = XFMR_MINI-CIRCUITS_TRS1.5-182+: 50 Ohms 10 to 1800MHz RF Transformer; Power: 1W; Part Number: XFMR_MINI-CIRCUITS_TRS1.5-182+; Component Kind: Standard; Component Type: Standard; Pin Count: 4; Value: 1:1.5; Status: None; Part Description: 50 Ohms 10 to 1800MHz RF Transformer; Manufacturer: MINI-CIRCUITS; Mounted: Yes; Socket: No; Sense: No; SMD: Yes; ComponentHeight: 3.05mm; HelpURL: \\cern.ch\dfs\Applications\Altium\Datasheets\XFMR_MINI-CIRCUITS_TRS1-5-182+.pdf; Author: CERN DEM BC; CreateDate: 09.06.2021; LatestRevisionDate: 09.06.2021